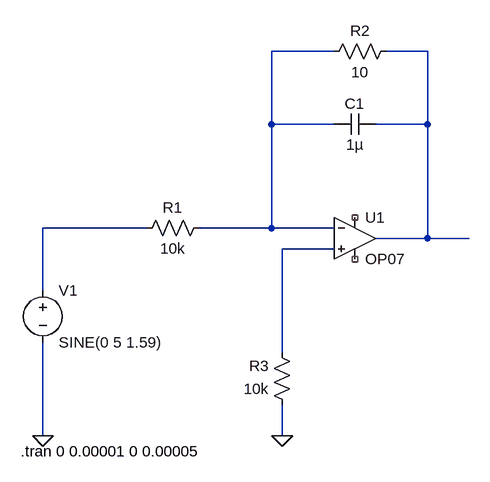
[diagram p0: schematic Integrator using Op-amp.asc]
Integrator using Op-amp.asc, the LTspice schematic file:
Version 4
SHEET 1 880 680
WIRE 272 -96 176 -96
WIRE 416 -96 352 -96
WIRE 176 16 176 -96
WIRE 272 16 176 16
WIRE 416 16 416 -96
WIRE 416 16 336 16
WIRE -16 176 -176 176
WIRE 176 176 176 16
WIRE 176 176 64 176
WIRE 272 176 176 176
WIRE 416 192 416 16
WIRE 416 192 336 192
WIRE 480 192 416 192
WIRE 272 208 192 208
WIRE -176 272 -176 176
WIRE 192 368 192 208
WIRE -176 496 -176 352
WIRE 192 496 192 448
FLAG -176 496 0
FLAG 192 496 0
SYMBOL OpAmps\\OP07 304 128 R0
SYMATTR InstName U1
SYMBOL res 80 160 R90
WINDOW 0 0 56 VBottom 2
WINDOW 3 32 56 VTop 2
SYMATTR InstName R1
SYMATTR Value 10k
SYMBOL res 208 464 R180
WINDOW 0 36 76 Left 2
WINDOW 3 36 40 Left 2
SYMATTR InstName R3
SYMATTR Value 10k
SYMBOL cap 336 0 R90
WINDOW 0 0 32 VBottom 2
WINDOW 3 32 32 VTop 2
SYMATTR InstName C1
SYMATTR Value 1µ
SYMBOL voltage -176 256 R0
WINDOW 123 0 0 Left 0
WINDOW 39 0 0 Left 0
SYMATTR InstName V1
SYMATTR Value SINE(0 5 1.59)
SYMBOL res 368 -112 R90
WINDOW 0 0 56 VBottom 2
WINDOW 3 32 56 VTop 2
SYMATTR InstName R2
SYMATTR Value 10
TEXT -210 520 Left 2 !.tran 0 0.00001 0 0.00005

The netlist it stands for:
* Integrator using Op-amp.asc
XU1 N004 N001 NC_01 NC_02 N002 LT1001  ; OP07, pins In+ In- V+ V- OUT
R1 N001 N003 10k
R3 0 N004 10k
C1 N002 N001 1µ
V1 N003 0 SINE(0 5 1.59)
R2 N002 N001 10
.tran 0 0.00001 0 0.00005
.lib LTC.lib
.backanno
.end